# Altium project MCU009A.PrjPcb (part 4 of 4)

## Sheet MCU009A_EmuInterface.SchDoc: EmuInterface
size 431 x 279 mm; Date: Not shown in title block; ApprovedBy: Not shown in title block; CheckedBy: Not shown in title block; Author: Not shown in title block; CompanyName: Not shown in title block; Engineer: Not shown in title block; Organization: Not shown in title block; Address1: Not shown in title block; Address2: Not shown in title block; Address3: Not shown in title block; Address4: Not shown in title block; DocumentNumber: 6; Revision: Use project parameter SCH_Rev; SheetNumber: 6; SheetTotal: 7; PageSetup: Record=PageOptions|CenterHorizontal=True|CenterVertical=True|PrintScale=1.00|XCorrection=1.00|YCorrection=1.00|PrintKind=0|BorderSize=5000000|LeftOffset=0|BottomOffset=0|Orientation=2|PaperLength=1000|PaperWidth=1000|Scale=100|PaperSource=15|PrintQuality=600|MediaType=1|DitherType=10|PaperKind=Letter|PrintScaleMode=1; CurrentTime: Not shown in title block; CurrentDate: Not shown in title block; Time: Not shown in title block; DocumentFullPathAndName: Not shown in title block; DocumentName: Not shown in title block; ModifiedDate: Not shown in title block; ImagePath: Not shown in title block
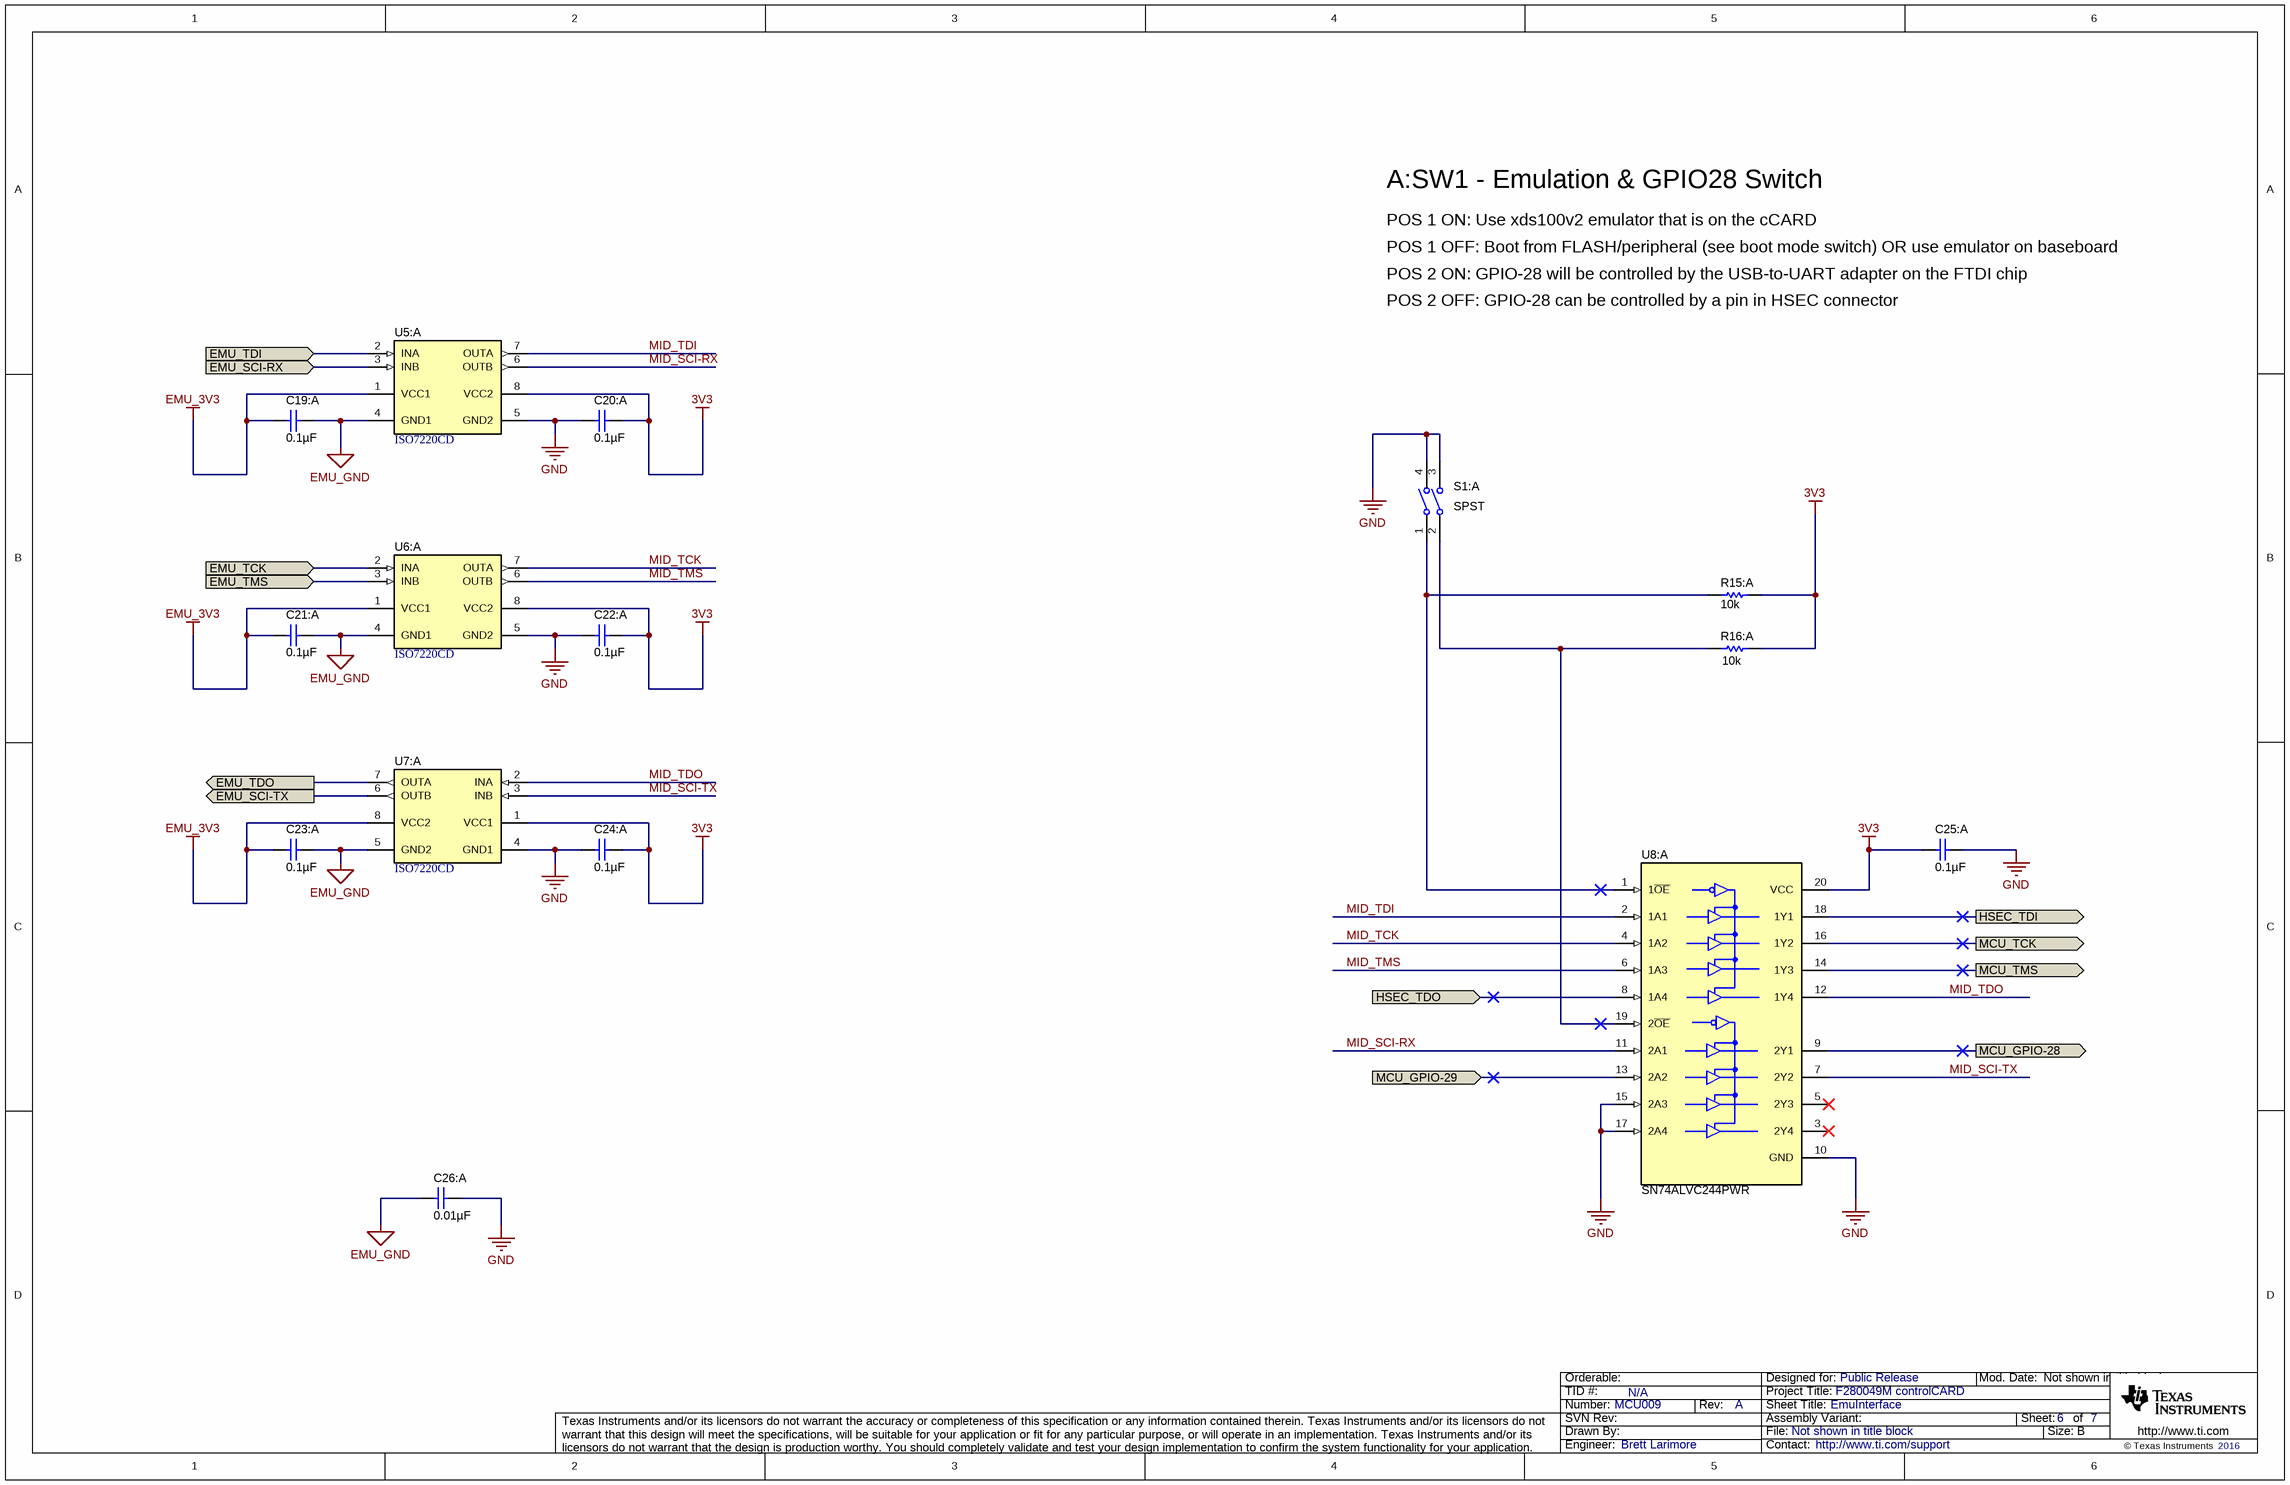
[diagram p6: MCU009A_EmuInterface.SchDoc]

### Parts
C19:A  ValueDisplayed: 0.1µF  [0402]  (hidden comment: GRM155R71A104KA01D)
C20:A  ValueDisplayed: 0.1µF  [0402]  (hidden comment: GRM155R71A104KA01D)
C21:A  ValueDisplayed: 0.1µF  [0402]  (hidden comment: GRM155R71A104KA01D)
C22:A  ValueDisplayed: 0.1µF  [0402]  (hidden comment: GRM155R71A104KA01D)
C23:A  ValueDisplayed: 0.1µF  [0402]  (hidden comment: GRM155R71A104KA01D)
C24:A  ValueDisplayed: 0.1µF  [0402]  (hidden comment: GRM155R71A104KA01D)
C25:A  ValueDisplayed: 0.1µF  [0402]  (hidden comment: GRM155R71A104KA01D)
C26:A  ValueDisplayed: 0.01µF  [1812]  (hidden comment: 1812SC103KAT1A)
R15:A  ValueDisplayed: 10k  [0402]  (hidden comment: CRCW040210K0JNED)
R16:A  ValueDisplayed: 10k  [0402]  (hidden comment: CRCW040210K0JNED)
S1:A  Circuit: SPST  [SW_218-2LP]  (hidden comment: 218-2LPST)
U5:A  ISO7220CD  [D0008A_N]
U6:A  ISO7220CD  [D0008A_N]
U7:A  ISO7220CD  [D0008A_N]
U8:A  SN74ALVC244PWR  [PW0020A_N]

### Ports
EMU_SCI-RX (in), EMU_SCI-TX (out), EMU_TCK (in), EMU_TDI (in), EMU_TDO (out), EMU_TMS (in), HSEC_TDI (out), HSEC_TDO (in), MCU_GPIO-28 (out), MCU_GPIO-29 (in), MCU_TCK (out), MCU_TMS (out)

### Nets
3V3: C20:A.1 C22:A.1 C24:A.1 C25:A.2 R15:A.2 R16:A.2 U5:A.8(VCC2) U6:A.8(VCC2) U7:A.1(VCC1) U8:A.20(VCC)
EMU_3V3: C19:A.2 C21:A.2 C23:A.2 U5:A.1(VCC1) U6:A.1(VCC1) U7:A.8(VCC2)
EMU_GND: C19:A.1 C21:A.1 C23:A.1 C26:A.2 U5:A.4(GND1) U6:A.4(GND1) U7:A.5(GND2)
GND: C20:A.2 C22:A.2 C24:A.2 C25:A.1 C26:A.1 S1:A.3 S1:A.4 U5:A.5(GND2) U6:A.5(GND2) U7:A.4(GND1) U8:A.10(GND) U8:A.15(2A3) U8:A.17(2A4)
EMU_SCI-RX: U5:A.3(INB) ; port EMU_SCI-RX
EMU_SCI-TX: U7:A.6(OUTB) ; port EMU_SCI-TX
EMU_TCK: U6:A.2(INA) ; port EMU_TCK
EMU_TDI: U5:A.2(INA) ; port EMU_TDI
EMU_TDO: U7:A.7(OUTA) ; port EMU_TDO
EMU_TMS: U6:A.3(INB) ; port EMU_TMS
HSEC_TDI: U8:A.18(1Y1) ; port HSEC_TDI
HSEC_TDO: U8:A.8(1A4) ; port HSEC_TDO
MCU_GPIO-28: U8:A.9(2Y1) ; port MCU_GPIO-28
MCU_GPIO-29: U8:A.13(2A2) ; port MCU_GPIO-29
MCU_TCK: U8:A.16(1Y2) ; port MCU_TCK
MCU_TMS: U8:A.14(1Y3) ; port MCU_TMS
MID_SCI-RX: U5:A.6(OUTB) U8:A.11(2A1)
MID_SCI-TX: U7:A.3(INB) U8:A.7(2Y2)
MID_TCK: U6:A.7(OUTA) U8:A.4(1A2)
MID_TDI: U5:A.7(OUTA) U8:A.2(1A1)
MID_TDO: U7:A.2(INA) U8:A.12(1Y4)
MID_TMS: U6:A.6(OUTB) U8:A.6(1A3)
NetR15:A_1: R15:A.1 S1:A.1 U8:A.1(1~{OE})
NetR16:A_1: R16:A.1 S1:A.2 U8:A.19(2~{OE})

Not connected (* = marked no-connect by the designer): U8:A 3(2Y4)* 5(2Y3)*

### Notes on the sheet
- A:SW1 - Emulation & GPIO28 Switch
- POS 1 ON: Use xds100v2 emulator that is on the cCARD
- POS 1 OFF: Boot from FLASH/peripheral (see boot mode switch) OR use emulator on baseboard
- POS 2 ON: GPIO-28 will be controlled by the USB-to-UART adapter on the FTDI chip
- POS 2 OFF: GPIO-28 can be controlled by a pin in HSEC connector
- Drawn By:
- SVN Rev:
- Number:
- TID #:
- Orderable:
- Rev:
- Sheet Title:
- File:
- Project Title:
- Designed for:
- Assembly Variant:
- Mod. Date:
- Sheet:
- Size:
- of
- B
- http://www.ti.com
- Texas Instruments and/or its licensors do not warrant the accuracy or completeness of this specification or any information contained therein. Texas Instruments and/or its licensors do not warrant that this design will meet the specifications, will be suitable for your application or fit for any particular purpose, or will operate in an implementation. Texas Instruments and/or its licensors do not warrant that the design is production worthy. You should completely validate and test your design implementation to confirm the system functionality for your application.
- Engineer:
- Contact:
- © Texas Instruments

### Library data of the parts
C19:A C20:A C21:A C22:A C23:A C24:A C25:A = GRM155R71A104KA01D: CAP, CERM, 0.1 µF, 10 V, +/- 10%, X7R, 0402; Manufacturer: MuRata; Polarized: N; CompType: Capacitor; Value: 0.1uF; U/M: EA; Cap_F: 0.0000001; Tolerance_%: 10; Value1: Unknown; Value2: 10V; TaMin_C: -55; TaMax_C: 125; AEC Category: Q200; SizeArea_mm2: 0.5; SizeAreaWB_mm2: 3; SizeX_mm: 1; SizeZ_mm: 0.6; SymbolVersion: 2008-07-09; PartNumber: GRM155R71A104KA01D; PackageReference: 0402; RoHS: Y; VDC_V: 10; MountType: SMT; Technology: Ceramic; TempCo: X7R; Cap_Case: 0402; Published: 2008-06-19; Publisher: Texas Instruments; LatestRevisionDate: 2016-10-03; ComponentLink1Description: Datasheet link; ComponentLink1URL: http://search.murata.co.jp/Ceramy/PnsearchViewAction.do?HnOFG=ON&HnNFG=ON&SEL_CNT=50&sLang=en&sKey=GRM155R71A104KA01D&x=9&y=9&search=startwith; Supplier 1: Digi-Key; Supplier Part Number 1: GRM155R71A104KA01D-ND; Supplier 2: Mouser; Supplier Part Number 2: 81-GRM155R71A104KA1D; Supplier 3: Farnell; Supplier Part Number 3: 1828860; AEC Qualified: ?; SizeY_mm: 0.5
C26:A = 1812SC103KAT1A: CAP, CERM, 0.01 µF, 1500 V, +/- 10%, X7R, 1812; Manufacturer: AVX; Polarized: N; CompType: Capacitor; Value: 0.01uF; U/M: EA; Cap_F: 0.00000001; Tolerance_%: 10; ESR_ohm: 0.05; Value1: 0.05 ohm; VDC_V: 1500; Value2: 1500V; TaMin_C: -55; TaMax_C: 125; AEC Category: Q200; SizeArea_mm2: 14.4; SizeAreaWB_mm2: 23.1; SizeX_mm: 4.5; SizeY_mm: 3.2; SizeZ_mm: 1.35; SymbolVersion: 2008-07-09; PartNumber: 1812SC103KAT1A; PackageReference: 1812; RoHS: Y; MountType: SMT; Technology: Ceramic; TempCo: X7R; Cap_Case: 1812; Published: 2008-06-19; Publisher: Texas Instruments; LatestRevisionDate: 2016-10-03; ComponentLink1Description: Datasheet link; ComponentLink1URL: http://datasheets.avx.com/AVX-HV_MLCC.pdf; Supplier 1: Digi-Key; Supplier Part Number 1: 478-4735-1-ND; Supplier 2: Mouser; Supplier Part Number 2: 581-1812SC103KAT1A; Supplier 3: Farnell; Supplier Part Number 3: 1582808; AEC Qualified: N; AEC Grade: N/A
R15:A R16:A = CRCW040210K0JNED: RES, 10 k, 5%, 0.063 W, 0402; Manufacturer: Vishay-Dale; CompType: Resistor; Value: 10k; Res_ohm: 10000; Value_Code: 10k0; Tolerance_%: 5; Power_W: 0.063; Value2: 0.063W; VDC_V: 50; TempCo: 200 ppm/C; EIA_Code: E24; U/M: EA; AEC Category: Q200; SizeArea_mm2: 0.5; SizeX_mm: 1; SizeZ_mm: 0.6; SymbolVersion: 2009-05-29; PartNumber: CRCW040210K0JNED; PackageReference: 0402; RoHS: Y; Value1: 5%; MountType: SMT; Technology: Thick Film; Published: 2008-06-26; Publisher: Texas Instruments; LatestRevisionDate: 2016-10-03; ComponentLink1Description: Datasheet link; ComponentLink1URL: http://www.vishay.com/docs/20035/dcrcwe3.pdf; Supplier 1: Digi-Key; Supplier Part Number 1: 541-10KJCT-ND; Supplier 2: Mouser; Supplier Part Number 2: 71-CRCW0402J-10K-E3; Supplier 3: Farnell; Supplier Part Number 3: 1514663; AEC Qualified: ?; SizeY_mm: 0.5
S1:A = 218-2LPST: Switch, SPST, 2 Pos, 25mA, 24VDC, SMD; Manufacturer: CTS Electrocomponents; SymbolCreator: Altium; VDC_V: 24; SwitchFunction: Off-On; PositionCount: 2; CurrentRating_mA: 25; SymbolVersion: 2015-05-13; PartNumber: 218-2LPST; MountType: SMT; ComponentLink1Description: Datasheet Link; ComponentLink1URL: http://www.ctscorp.com/components/Datasheets/218.pdf; RoHS: Y; Orientation: Top Actuated; CompType: Switch; PackageReference: 3.71x5.8mm; Publisher: Texas Instruments; LatestRevisionDate: 2016-10-04; Supplier 1: Digi-Key; Supplier Part Number 1: CT2182LPST-ND; Supplier 2: Mouser; Supplier Part Number 2: 774-2182LPST
U5:A U6:A U7:A = ISO7220CD: 25 Mbps Dual Channels, 2 / 0, Digital Isolator, 3.3 V / 5 V, -40 to +125 degC, 8-pin SOIC (D), Green (RoHS & no Sb/Br); Manufacturer: Texas Instruments; Alternate PartNumber: Equivalent; Datarate(Mbps): 25; Input Noise Filter: Yes; Insulation Rating(VRMS): 2500; Prop Delay(Max)(ns): 42; Rating: Catalog; Supply Voltage(s)(V): 3.3, 5; TTL/CMOS Input Threshold: TTL; DatasheetVersion: SLLS755L; PackageVersion: 4040047-3/M, 06/2011; PackageReference: D0008A; PackageDescription: 8-Pin Plastic Small Outline, Body 4.9 x 3.9 mm, Pitch 1.27 mm; Supplier 1: Digi-Key; Supplier Part Number 1: 296-26075-5-ND; Supplier 2: Farnell; Supplier Part Number 2: 1390644; Supplier 3: Newark; Supplier Part Number 3: 48M0668; Supplier 4: Mouser; Supplier Part Number 4: 595-ISO7220CD; Eco-Plan: Green (RoHS & no Sb/Br); SubFamily: Isolator; Thermal Shutdown: No; MountType: SMT; Code_JEDEC: MS-012; PartNumber: ISO7220CD; ComponentLink1Description: Manufacturer URL; ComponentLink1URL: http://www.ti.com/; ComponentLink2Description: Datasheet; ComponentLink2URL: http://www.ti.com/general/docs/lit/getliterature.tsp?genericPartNumber=ISO7220C&fileType=pdf; ComponentLink3Description: Package Specification; ComponentLink3URL: http://www.ti.com/litv/pdf/msoi002j; ComponentLink4Description: SamplesURL; ComponentLink4URL: http://www.ti.com/product/iso7220c#samples; Alternate Manufacturer: Texas Instruments
U8:A = SN74ALVC244PWR: OCTAL BUFFER/DRIVER WITH 3-STATE OUTPUTS, PW0020A (TSSOP-20); Manufacturer: Texas Instruments; SymbolCreator: Altium; CompType: IC; U/M: EA; SizeArea_mm2: 43.56; SizeAreaWB_mm2: 73.96; SizeX_mm: 6.6; SizeZ_mm: 1.2; SymbolVersion: 2015-08-13; PartNumber: SN74ALVC244PWR; Alternate PartNumber: SN74ALVC244PW; PackageReference: PW0020A; MountType: SMT; ComponentLink1Description: Datasheet Link; ComponentLink1URL: http://www.ti.com/lit/ds/symlink/sn74alvc244.pdf; RoHS: Y; Publisher: Texas Instruments; LatestRevisionDate: 2016-10-04; Alternate Manufacturer: Texas Instruments; PackageDescription: TSSOP-20; SizeY_mm: 6.6

## Nets that join several sheets
3V3: MCU009A_Connector+IO (R1.1 R2.2 R8.2 R9.2), MCU009A_Power+Misc (24 pins), MCU009A_EmuInterface (10 pins)
EMU_3V3: MCU009A_Xds100v2Emu (21 pins), MCU009A_EmuInterface (6 pins)
EMU_GND: MCU009A_Xds100v2Emu (41 pins), MCU009A_EmuInterface (7 pins)
GND: MCU009A_Connector+IO (12 pins), MCU009A_Power+Misc (45 pins), MCU009A_ADC (42 pins), MCU009A_EmuInterface (13 pins)
HSEC_5V0: MCU009A_Connector+IO (EC1.48 EC1.84 EC1.98 EC1.112), MCU009A_Power+Misc (5 pins)
MCU_A_3V3: MCU009A_Power+Misc (6 pins), MCU009A_ADC (7 pins)
EMU_SCI-RX: MCU009A_Xds100v2Emu (U2:A.38), MCU009A_EmuInterface (U5:A.3)
EMU_SCI-TX: MCU009A_Xds100v2Emu (U2:A.39), MCU009A_EmuInterface (U7:A.6)
EMU_TCK: MCU009A_Xds100v2Emu (R3:A.1 U2:A.16), MCU009A_EmuInterface (U6:A.2)
EMU_TDI: MCU009A_Xds100v2Emu (U2:A.17), MCU009A_EmuInterface (U5:A.2)
EMU_TDO: MCU009A_Xds100v2Emu (U2:A.18), MCU009A_EmuInterface (U7:A.7)
EMU_TMS: MCU009A_Xds100v2Emu (R2:A.1 U2:A.19), MCU009A_EmuInterface (U6:A.3)
HSEC_ADC-A0,B15,C15,DACA: MCU009A_Connector+IO (EC1.9), MCU009A_ADC (R36.2 U5.1)
HSEC_ADC-A1,DACB: MCU009A_Connector+IO (EC1.11), MCU009A_ADC (R38.2 U5.3)
HSEC_ADC-A2,B6,PGA1_IN: MCU009A_Connector+IO (EC1.15), MCU009A_ADC (R37.1 U6.1)
HSEC_ADC-A3: MCU009A_Connector+IO (EC1.17), MCU009A_ADC (R41.2 U5.4)
HSEC_ADC-A4,B8,PGA2_IN: MCU009A_Connector+IO (EC1.21), MCU009A_ADC (R39.1 U6.3)
HSEC_ADC-A5: MCU009A_Connector+IO (EC1.23), MCU009A_ADC (R44.2 U5.6)
HSEC_ADC-A6,PGA5_IN: MCU009A_Connector+IO (EC1.25), MCU009A_ADC (R43.1 U8.1)
HSEC_ADC-A8,PGA6_OF: MCU009A_Connector+IO (EC1.33), MCU009A_ADC (R35.1 U8.3)
HSEC_ADC-A9: MCU009A_Connector+IO (EC1.27), MCU009A_ADC (R47.2 U7.1)
HSEC_ADC-B0: MCU009A_Connector+IO (EC1.12), MCU009A_ADC (R49.2 U7.3)
HSEC_ADC-B1,A10,C10,PGA7_IN: MCU009A_Connector+IO (EC1.14), MCU009A_ADC (R46.1 U8.6)
HSEC_ADC-B2,C6,PGA3_IN: MCU009A_Connector+IO (EC1.18), MCU009A_ADC (R40.1 U6.4)
HSEC_ADC-B3,VDAC: MCU009A_Connector+IO (EC1.20), MCU009A_ADC (R53.2 U7.4)
HSEC_ADC-B4,C8,C3,PGA4_IN: MCU009A_Connector+IO (EC1.24), MCU009A_ADC (R42.1 U6.6)
HSEC_ADC-C0: MCU009A_Connector+IO (EC1.26), MCU009A_ADC (R60.2 U7.6)
HSEC_ADC-C1: MCU009A_Connector+IO (EC1.28), MCU009A_ADC (R61.2 U9.1)
HSEC_ADC-C2: MCU009A_Connector+IO (EC1.30), MCU009A_ADC (R62.2 U9.3)
HSEC_ADC-C4: MCU009A_Connector+IO (EC1.34), MCU009A_ADC (R63.2 U9.4)
HSEC_ADC-C5,PGA6_IN: MCU009A_Connector+IO (EC1.31), MCU009A_ADC (R45.1 U8.4)
HSEC_ADC-C14: MCU009A_Connector+IO (EC1.36), MCU009A_ADC (R64.2 U9.6)
HSEC_ADCVREFHI-Ext: MCU009A_Connector+IO (EC1.45), MCU009A_ADC (S8.1 S8.2)
HSEC_GPIO-22: MCU009A_Connector+IO (EC1.72), MCU009A_Power+Misc (R19.2)
HSEC_GPIO-23: MCU009A_Connector+IO (EC1.64), MCU009A_Power+Misc (R18.2)
HSEC_PGA1_GND: MCU009A_Connector+IO (EC1.13), MCU009A_ADC (R48.1)
HSEC_PGA3_GND: MCU009A_Connector+IO (EC1.16), MCU009A_ADC (R50.1)
HSEC_PGA5_GND: MCU009A_Connector+IO (EC1.29), MCU009A_ADC (R51.1)
HSEC_PGA7_GND: MCU009A_Connector+IO (EC1.10), MCU009A_ADC (R54.1)
HSEC_PGA246_GND: MCU009A_Connector+IO (EC1.19 EC1.22 EC1.35), MCU009A_ADC (R52.1)
HSEC_TDI: MCU009A_Connector+IO (EC1.8 R8.1 S4.3), MCU009A_EmuInterface (U8:A.18)
HSEC_TDO: MCU009A_Connector+IO (EC1.6 R9.1 S4.6), MCU009A_EmuInterface (U8:A.8)
MCU_GPIO-18: MCU009A_Connector+IO (R7.2 U1.68), MCU009A_Power+Misc (R16.2)
MCU_GPIO-22: MCU009A_Connector+IO (U1.83), MCU009A_Power+Misc (L3.2 R19.1 R22.2)
MCU_GPIO-23: MCU009A_Connector+IO (U1.81), MCU009A_Power+Misc (R18.1 R21.2 R24.2)
MCU_GPIO-24: MCU009A_Connector+IO (S5.2 U1.56), MCU009A_Power+Misc (R25.2 S1.2)
MCU_GPIO-28: MCU009A_Connector+IO (EC1.76 U1.1), MCU009A_EmuInterface (U8:A.9)
MCU_GPIO-29: MCU009A_Connector+IO (EC1.78 U1.100), MCU009A_EmuInterface (U8:A.13)
MCU_GPIO-31: MCU009A_Connector+IO (EC1.74 U1.99), MCU009A_Power+Misc (R12.1 U2.1)
MCU_GPIO-32: MCU009A_Connector+IO (EC1.82 U1.64), MCU009A_Power+Misc (R26.1 S1.1)
MCU_GPIO-34: MCU009A_Connector+IO (EC1.86 U1.94), MCU009A_Power+Misc (R13.1 U2.3)
MCU_TCK: MCU009A_Connector+IO (EC1.5), MCU009A_Power+Misc (U1.60), MCU009A_EmuInterface (U8:A.16)
MCU_TMS: MCU009A_Connector+IO (EC1.3), MCU009A_Power+Misc (R31.1 U1.62), MCU009A_EmuInterface (U8:A.14)
MCU_XRSn: MCU009A_Connector+IO (EC1.120), MCU009A_Power+Misc (5 pins)

## Assembly variants
001: not fitted C10 C11 C11 C12 C12 C28 C38 C39 C40 C41 C42 C43 C44 C45 C46 C47 C48 C49 C50 C51 C52 C53 C54 C55 C56 D4 FID1 FID2 FID3 FID4 FID5 FID6 R7 R12:A R13:A R17 R19 R20 R24 R27 R52 R53 R54 R57 R58